# EAGLE design hardware-crackme (EAGLE 7.7.0)

## Sheet 1 of 2
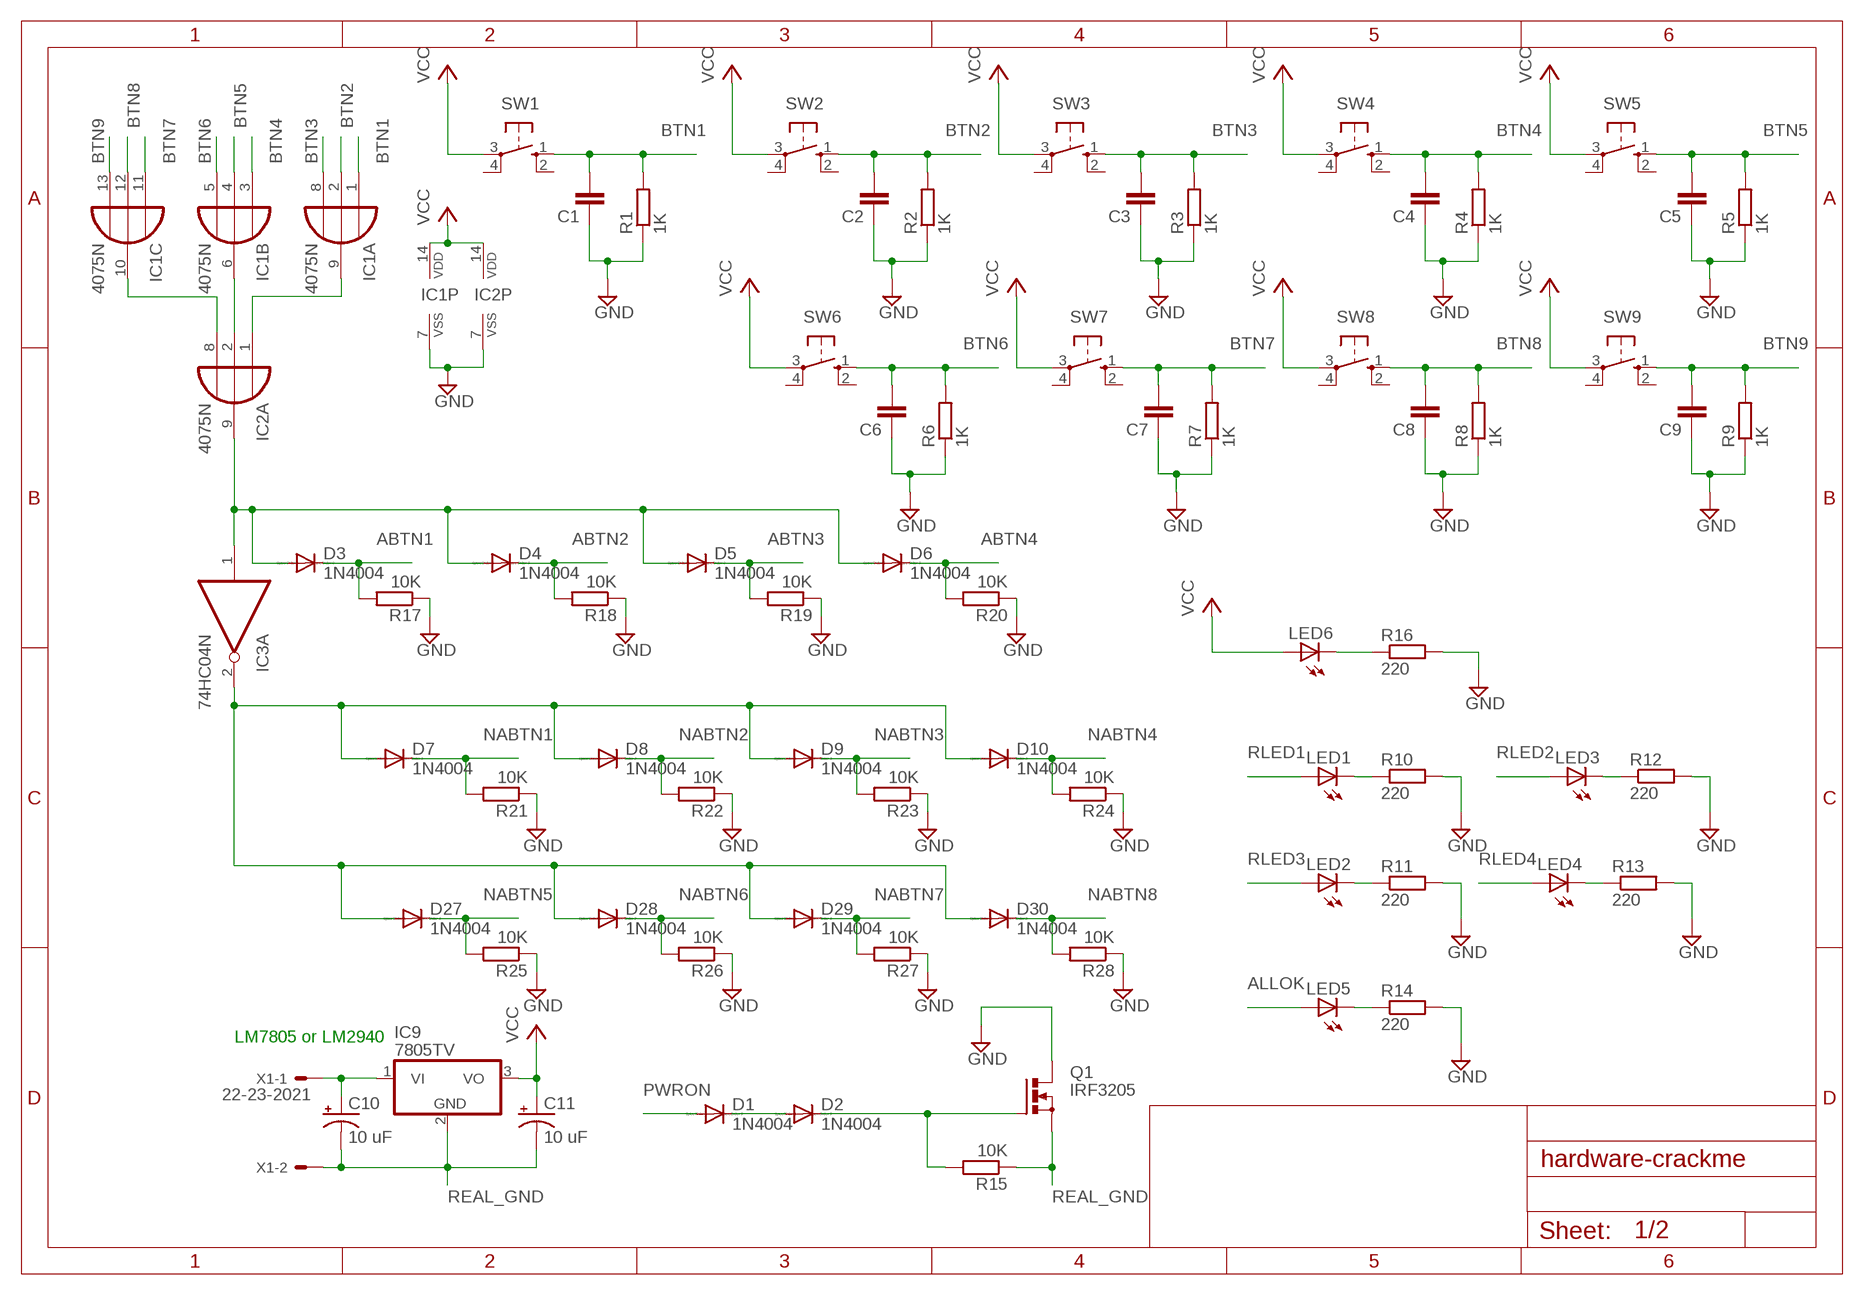
[diagram p0: schematic, sheet 1]

### Parts
C1  C-EU050-025X075  [C050-025X075]
C2  C-EU050-025X075  [C050-025X075]
C3  C-EU050-025X075  [C050-025X075]
C4  C-EU050-025X075  [C050-025X075]
C5  C-EU050-025X075  [C050-025X075]
C6  C-EU050-025X075  [C050-025X075]
C7  C-EU050-025X075  [C050-025X075]
C8  C-EU050-025X075  [C050-025X075]
C9  C-EU050-025X075  [C050-025X075]
C10  10 uF  CPOL-USE2.5-7  [E2,5-7]
C11  10 uF  CPOL-USE2.5-7  [E2,5-7]
D1  1N4004  [DO41-10]
D2  1N4004  [DO41-10]
D3  1N4004  [DO41-10]
D4  1N4004  [DO41-10]
D5  1N4004  [DO41-10]
D6  1N4004  [DO41-10]
D7  1N4004  [DO41-10]
D8  1N4004  [DO41-10]
D9  1N4004  [DO41-10]
D10  1N4004  [DO41-10]
D27  1N4004  [DO41-10]
D28  1N4004  [DO41-10]
D29  1N4004  [DO41-10]
D30  1N4004  [DO41-10]
IC1  4075N  [DIL14]
IC2  4075N  [DIL14]
IC3  74HC04N  [DIL14]
IC9  7805TV  [TO220V]
LED1  LED5MM  [LED5MM]
LED2  LED5MM  [LED5MM]
LED3  LED5MM  [LED5MM]
LED4  LED5MM  [LED5MM]
LED5  LED5MM  [LED5MM]
LED6  LED5MM  [LED5MM]
Q1  IRF3205  PMOSFET_NTO220BV  [TO220BV]
R1  1K  R-EU_0207/7  [0207/7]
R2  1K  R-EU_0207/7  [0207/7]
R3  1K  R-EU_0207/7  [0207/7]
R4  1K  R-EU_0207/7  [0207/7]
R5  1K  R-EU_0207/7  [0207/7]
R6  1K  R-EU_0207/7  [0207/7]
R7  1K  R-EU_0207/7  [0207/7]
R8  1K  R-EU_0207/7  [0207/7]
R9  1K  R-EU_0207/7  [0207/7]
R10  220  R-EU_0207/7  [0207/7]
R11  220  R-EU_0207/7  [0207/7]
R12  220  R-EU_0207/7  [0207/7]
R13  220  R-EU_0207/7  [0207/7]
R14  220  R-EU_0207/7  [0207/7]
R15  10K  R-EU_0207/7  [0207/7]
R16  220  R-EU_0207/7  [0207/7]
R17  10K  R-EU_0207/7  [0207/7]
R18  10K  R-EU_0207/7  [0207/7]
R19  10K  R-EU_0207/7  [0207/7]
R20  10K  R-EU_0207/7  [0207/7]
R21  10K  R-EU_0207/7  [0207/7]
R22  10K  R-EU_0207/7  [0207/7]
R23  10K  R-EU_0207/7  [0207/7]
R24  10K  R-EU_0207/7  [0207/7]
R25  10K  R-EU_0207/7  [0207/7]
R26  10K  R-EU_0207/7  [0207/7]
R27  10K  R-EU_0207/7  [0207/7]
R28  10K  R-EU_0207/7  [0207/7]
SW1  10-XX  [B3F-10XX]
SW2  10-XX  [B3F-10XX]
SW3  10-XX  [B3F-10XX]
SW4  10-XX  [B3F-10XX]
SW5  10-XX  [B3F-10XX]
SW6  10-XX  [B3F-10XX]
SW7  10-XX  [B3F-10XX]
SW8  10-XX  [B3F-10XX]
SW9  10-XX  [B3F-10XX]
X1  22-23-2021  [22-23-2021]

### Nets
ABTN1: D3.C R17.2 ; also sheet 2
ABTN2: D4.C R18.2 ; also sheet 2
ABTN3: D5.C R19.2 ; also sheet 2
ABTN4: D6.C R20.2 ; also sheet 2
ALLOK: LED5.A ; also sheet 2
BTN1: C1.2 IC1.1(A:I0) R1.2 SW1.1(S) ; also sheet 2
BTN2: C2.2 IC1.2(A:I1) R2.2 SW2.1(S) ; also sheet 2
BTN3: C3.2 IC1.8(A:I2) R3.2 SW3.1(S) ; also sheet 2
BTN4: C4.2 IC1.3(B:I0) R4.2 SW4.1(S) ; also sheet 2
BTN5: C5.2 IC1.4(B:I1) R5.2 SW5.1(S) ; also sheet 2
BTN6: C6.2 IC1.5(B:I2) R6.2 SW6.1(S) ; also sheet 2
BTN7: C7.2 IC1.11(C:I0) R7.2 SW7.1(S) ; also sheet 2
BTN8: C8.2 IC1.12(C:I1) R8.2 SW8.1(S) ; also sheet 2
BTN9: C9.2 IC1.13(C:I2) R9.2 SW9.1(S) ; also sheet 2
GND: C1.1 C2.1 C3.1 C4.1 C5.1 C6.1 C7.1 C8.1 C9.1 IC1.7(P:VSS) IC2.7(P:VSS) Q1.D R1.1 R2.1 R3.1 R4.1 R5.1 R6.1 R7.1 R8.1 R9.1 R10.2 R11.2 R12.2 R13.2 R14.2 R16.2 R17.1 R18.1 R19.1 R20.1 R21.1 R22.1 R23.1 R24.1 R25.1 R26.1 R27.1 R28.1 ; also sheet 2
N$1: C10.+ IC9.1(VI) X1.1
N$2: D2.C Q1.G R15.2
N$3: LED1.K(C) R10.1
N$4: D1.C D2.A
N$5: LED2.K(C) R11.1
N$6: LED6.K(C) R16.1
N$7: LED3.K(C) R12.1
N$9: LED4.K(C) R13.1
N$11: LED5.K(C) R14.1
N$20: IC1.9(A:O) IC2.1(A:I0)
N$21: IC1.6(B:O) IC2.2(A:I1)
N$22: IC1.10(C:O) IC2.8(A:I2)
N$30: D3.A D4.A D5.A D6.A IC2.9(A:O) IC3.1(A:I)
N$32: D7.A D8.A D9.A D10.A D27.A D28.A D29.A D30.A IC3.2(A:O)
NABTN1: D7.C R21.2 ; also sheet 2
NABTN2: D8.C R22.2 ; also sheet 2
NABTN3: D9.C R23.2 ; also sheet 2
NABTN4: D10.C R24.2 ; also sheet 2
NABTN5: D27.C R25.2 ; also sheet 2
NABTN6: D28.C R26.2 ; also sheet 2
NABTN7: D29.C R27.2 ; also sheet 2
NABTN8: D30.C R28.2 ; also sheet 2
PWRON: D1.A ; also sheet 2
REAL_GND: C10.- C11.- IC9.2(GND) Q1.S R15.1 X1.2
RLED1: LED1.A ; also sheet 2
RLED2: LED3.A ; also sheet 2
RLED3: LED2.A ; also sheet 2
RLED4: LED4.A ; also sheet 2
VCC: C11.+ IC1.14(P:VDD) IC2.14(P:VDD) IC9.3(VO) LED6.A SW1.3(P) SW2.3(P) SW3.3(P) SW4.3(P) SW5.3(P) SW6.3(P) SW7.3(P) SW8.3(P) SW9.3(P) ; also sheet 2
Unconnected: SW1.2(S1) SW1.4(P1) SW2.2(S1) SW2.4(P1) SW3.2(S1) SW3.4(P1) SW4.2(S1) SW4.4(P1) SW5.2(S1) SW5.4(P1) SW6.2(S1) SW6.4(P1) SW7.2(S1) SW7.4(P1) SW8.2(S1) SW8.4(P1) SW9.2(S1) SW9.4(P1)

### Notes on the sheet
- LM7805 or LM2940

## Sheet 2 of 2
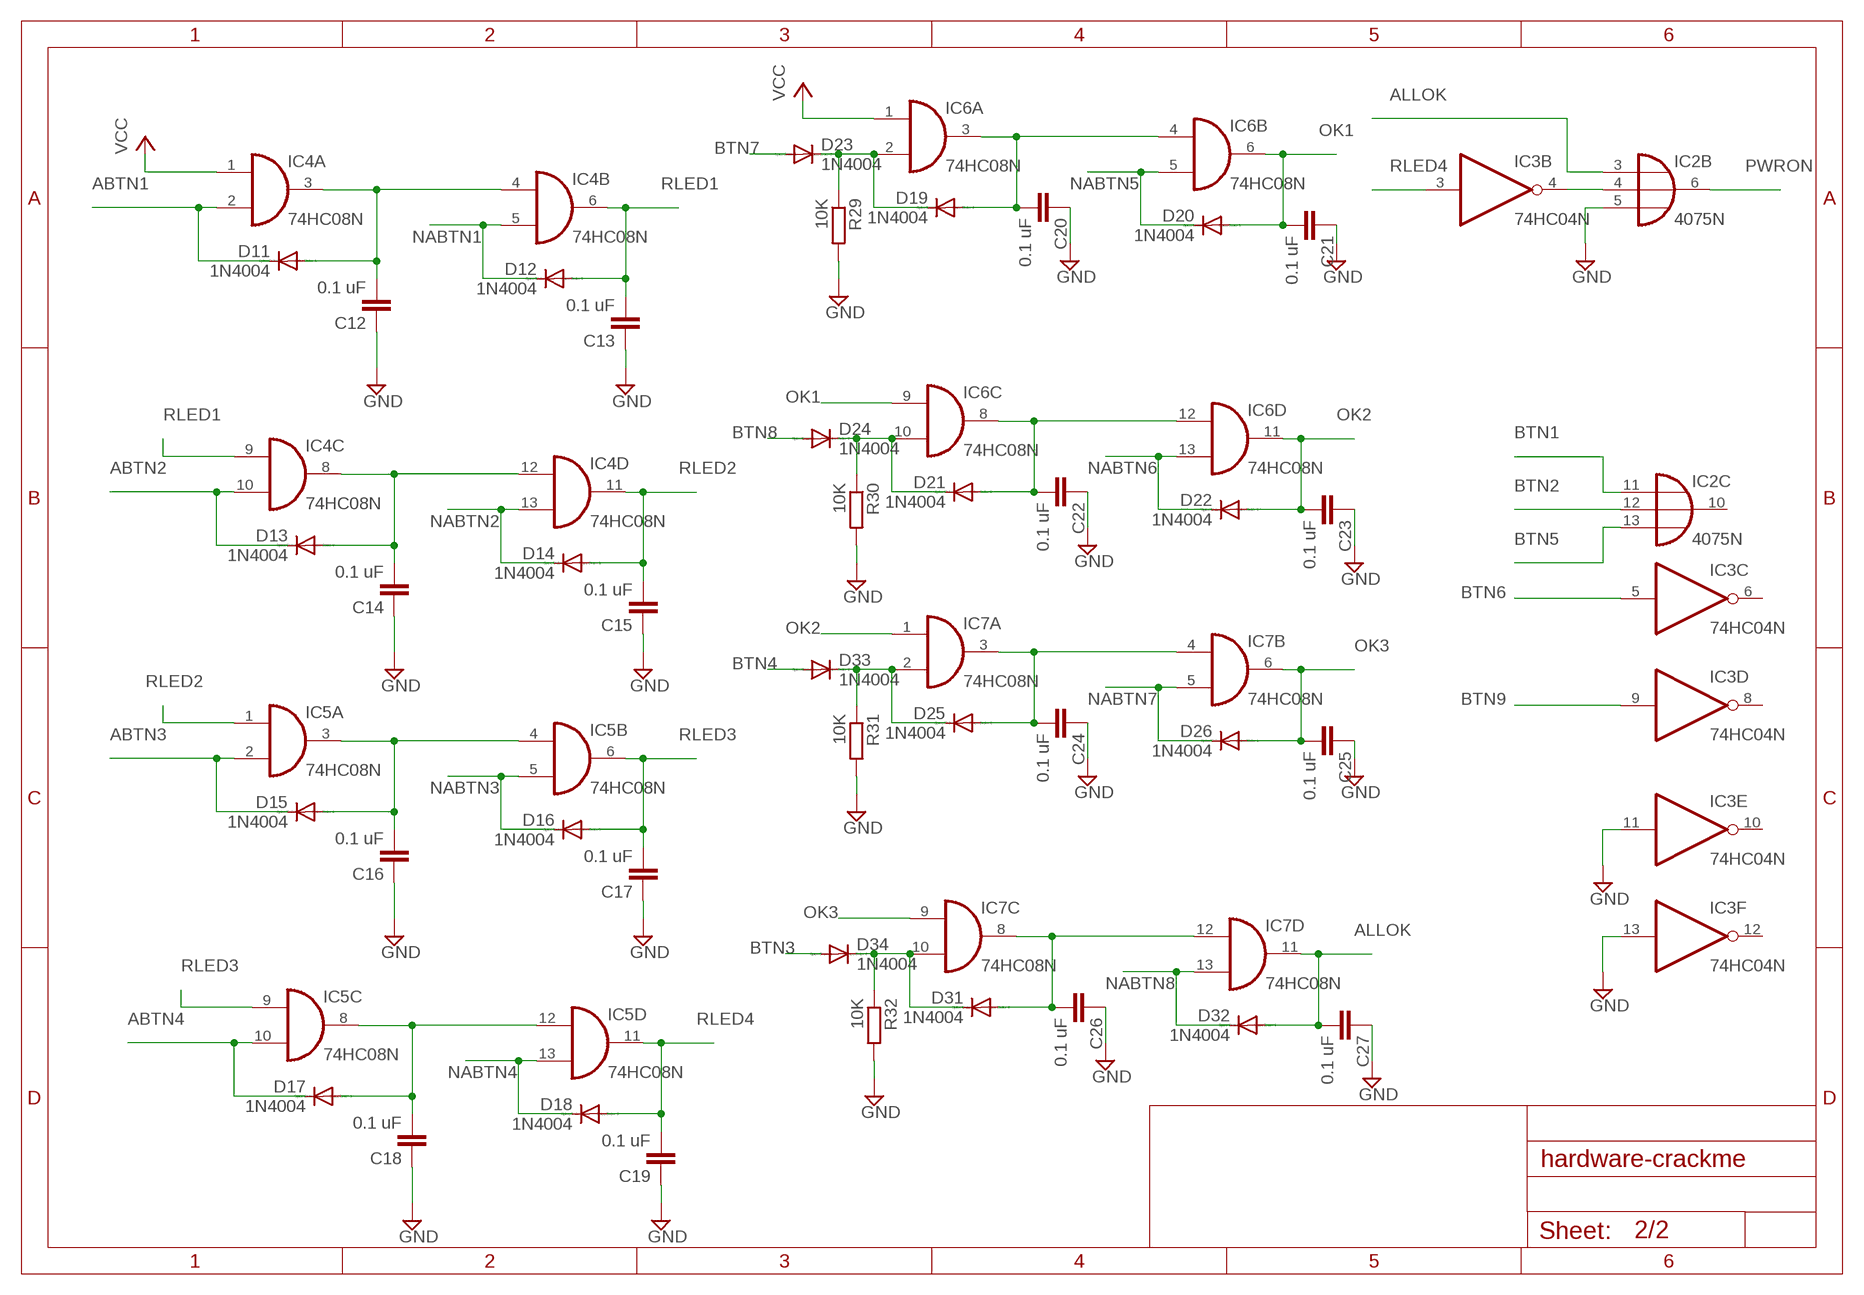
[diagram p1: schematic, sheet 2]

### Parts
C12  0.1 uF  C-EU050-025X075  [C050-025X075]
C13  0.1 uF  C-EU050-025X075  [C050-025X075]
C14  0.1 uF  C-EU050-025X075  [C050-025X075]
C15  0.1 uF  C-EU050-025X075  [C050-025X075]
C16  0.1 uF  C-EU050-025X075  [C050-025X075]
C17  0.1 uF  C-EU050-025X075  [C050-025X075]
C18  0.1 uF  C-EU050-025X075  [C050-025X075]
C19  0.1 uF  C-EU050-025X075  [C050-025X075]
C20  0.1 uF  C-EU050-025X075  [C050-025X075]
C21  0.1 uF  C-EU050-025X075  [C050-025X075]
C22  0.1 uF  C-EU050-025X075  [C050-025X075]
C23  0.1 uF  C-EU050-025X075  [C050-025X075]
C24  0.1 uF  C-EU050-025X075  [C050-025X075]
C25  0.1 uF  C-EU050-025X075  [C050-025X075]
C26  0.1 uF  C-EU050-025X075  [C050-025X075]
C27  0.1 uF  C-EU050-025X075  [C050-025X075]
D11  1N4004  [DO41-10]
D12  1N4004  [DO41-10]
D13  1N4004  [DO41-10]
D14  1N4004  [DO41-10]
D15  1N4004  [DO41-10]
D16  1N4004  [DO41-10]
D17  1N4004  [DO41-10]
D18  1N4004  [DO41-10]
D19  1N4004  [DO41-10]
D20  1N4004  [DO41-10]
D21  1N4004  [DO41-10]
D22  1N4004  [DO41-10]
D23  1N4004  [DO41-10]
D24  1N4004  [DO41-10]
D25  1N4004  [DO41-10]
D26  1N4004  [DO41-10]
D31  1N4004  [DO41-10]
D32  1N4004  [DO41-10]
D33  1N4004  [DO41-10]
D34  1N4004  [DO41-10]
IC4  74HC08N  [DIL14]
IC5  74HC08N  [DIL14]
IC6  74HC08N  [DIL14]
IC7  74HC08N  [DIL14]
R29  10K  R-EU_0207/7  [0207/7]
R30  10K  R-EU_0207/7  [0207/7]
R31  10K  R-EU_0207/7  [0207/7]
R32  10K  R-EU_0207/7  [0207/7]

### Nets
ABTN1: D11.C IC4.2(A:I1) ; also sheet 1
ABTN2: D13.C IC4.10(C:I1) ; also sheet 1
ABTN3: D15.C IC5.2(A:I1) ; also sheet 1
ABTN4: D17.C IC5.10(C:I1) ; also sheet 1
ALLOK: C27.2 D32.A IC2.3(B:I0) IC7.11(D:O) ; also sheet 1
BTN1: IC2.11(C:I0) ; also sheet 1
BTN2: IC2.12(C:I1) ; also sheet 1
BTN3: D34.A ; also sheet 1
BTN4: D33.A ; also sheet 1
BTN5: IC2.13(C:I2) ; also sheet 1
BTN6: IC3.5(C:I) ; also sheet 1
BTN7: D23.A ; also sheet 1
BTN8: D24.A ; also sheet 1
BTN9: IC3.9(D:I) ; also sheet 1
GND: C12.1 C13.1 C14.1 C15.1 C16.1 C17.1 C18.1 C19.1 C20.1 C21.1 C22.1 C23.1 C24.1 C25.1 C26.1 C27.1 IC2.5(B:I2) IC3.11(E:I) IC3.13(F:I) R29.2 R30.2 R31.2 R32.2 ; also sheet 1
N$10: C12.2 D11.A IC4.3(A:O) IC4.4(B:I0)
N$13: C14.2 D13.A IC4.8(C:O) IC4.12(D:I0)
N$14: IC2.4(B:I1) IC3.4(B:O)
N$15: C16.2 D15.A IC5.3(A:O) IC5.4(B:I0)
N$17: C18.2 D17.A IC5.8(C:O) IC5.12(D:I0)
N$19: C20.2 D19.A IC6.3(A:O) IC6.4(B:I0)
N$24: C22.2 D21.A IC6.8(C:O) IC6.12(D:I0)
N$26: D21.C D24.C IC6.10(C:I1) R30.1
N$29: D19.C D23.C IC6.2(A:I1) R29.1
N$31: C24.2 D25.A IC7.3(A:O) IC7.4(B:I0)
N$34: C26.2 D31.A IC7.8(C:O) IC7.12(D:I0)
N$36: D31.C D34.C IC7.10(C:I1) R32.1
N$39: D25.C D33.C IC7.2(A:I1) R31.1
NABTN1: D12.C IC4.5(B:I1) ; also sheet 1
NABTN2: D14.C IC4.13(D:I1) ; also sheet 1
NABTN3: D16.C IC5.5(B:I1) ; also sheet 1
NABTN4: D18.C IC5.13(D:I1) ; also sheet 1
NABTN5: D20.C IC6.5(B:I1) ; also sheet 1
NABTN6: D22.C IC6.13(D:I1) ; also sheet 1
NABTN7: D26.C IC7.5(B:I1) ; also sheet 1
NABTN8: D32.C IC7.13(D:I1) ; also sheet 1
OK1: C21.2 D20.A IC6.6(B:O) IC6.9(C:I0)
OK2: C23.2 D22.A IC6.11(D:O) IC7.1(A:I0)
OK3: C25.2 D26.A IC7.6(B:O) IC7.9(C:I0)
PWRON: IC2.6(B:O) ; also sheet 1
RLED1: C13.2 D12.A IC4.6(B:O) IC4.9(C:I0) ; also sheet 1
RLED2: C15.2 D14.A IC4.11(D:O) IC5.1(A:I0) ; also sheet 1
RLED3: C17.2 D16.A IC5.6(B:O) IC5.9(C:I0) ; also sheet 1
RLED4: C19.2 D18.A IC3.3(B:I) IC5.11(D:O) ; also sheet 1
VCC: IC4.1(A:I0) IC6.1(A:I0) ; also sheet 1
Unconnected: IC2.10(C:O) IC3.6(C:O) IC3.8(D:O) IC3.10(E:O) IC3.12(F:O)

## Power pins joined to a net without a drawn wire
GND: IC3.7(P:GND) IC4.7(P:GND) IC5.7(P:GND) IC6.7(P:GND) IC7.7(P:GND)
VCC: IC3.14(P:VCC) IC4.14(P:VCC) IC5.14(P:VCC) IC6.14(P:VCC) IC7.14(P:VCC)

## Library data of the parts
C1-C9 C12-C27 = rcl:C-EU: CAPACITOR, European symbol
C10 C11 = rcl:CPOL-US: POLARIZED CAPACITOR, American symbol
D1-D34 = diode:1N4004: DIODE general purpose rectifier, 1 A
IC1 = 40xx:4075: Triple 3-input OR; SUPPLY: VCC
IC2 = 40xx:4075: Triple 3-input OR
IC3 = 74xx-eu:74*04: Hex INVERTER
IC4-IC7 = 74xx-eu:74*08: Quad 2-input AND gate
IC9 = linear:78*: Positive VOLTAGE REGULATOR Source: http://cache.national.com/ds/LM/LM78L05.pdf http://www.fairchildsemi.com/ds/LM/LM7805.pdf
LED1-LED6 = led:LED: LED OSRAM: - CHIPLED LG R971, LG N971, LY N971, LG Q971, LY Q971, LO R971, LY R971 LH N974, LH R974 LS Q976, LO Q976, LY Q976 LO Q996 - Hyper CHIPLED LW Q18S LB Q993, LB Q99A, LB R99A - SideLED LS A670, LO A670, LY A670, LG A670, LP A670 LB A673, LV A673, LT A673, LW A673 LH A674 LY A675 LS A676, LA A676, LO A676, LY A676, LW A676 LS A679, LY A679, LG A679 - Hyper Micro SIDELED® LS Y876, LA Y876, LO Y876, LY Y876 LT Y87S - SmartLED LW L88C, LW L88S LB L89C, LB L89S, LG L890 LS L89K, LO L89K, LY L89K LS L896, LA L896, LO L896, LY L896 - TOPLED LS T670, LO T670, LY T670, LG T670, LP T670 LSG T670, LSP T670, LSY T670, LOP T670, LYG T670 LG T671, LOG T671, LSG T671 LB T673, LV T673, LT T673, LW T673 LH T674 LS T676, LA T676, LO T676, LY T676, LB T676, LH T676, LSB T676, LW T676 LB T67C, LV T67C, LT T67C, LS T67K, LO T67K, LY T67K, LW E67C LS E67B, LA E67B, LO E67B, LY E67B, LB E67C, LV E67C, LT E67C LW T67C LS T679, LY T679, LG T679 LS T770, LO T770, LY T770, LG T770, LP T770 LB T773, LV T773, LT T773, LW T773 LH T774 LS E675, LA E675, LY E675, LS T675 LS T776, LA T776, LO T776, LY T776, LB T776 LHGB T686 LT T68C, LB T68C - Hyper Mini TOPLED® LB M676 - Mini TOPLED Santana® LG M470 LS M47K, LO M47K, LY M47K Source: http://www.osram.convergy.de LUXEON: - LUMILED® LXK2-PW12-R00, LXK2-PW12-S00, LXK2-PW14-U00, LXK2-PW14-V00 LXK2-PM12-R00, LXK2-PM12-S00, LXK2-PM14-U00 LXK2-PE12-Q00, LXK2-PE12-R00, LXK2-PE12-S00, LXK2-PE14-T00, LXK2-PE14-U00 LXK2-PB12-K00, LXK2-PB12-L00, LXK2-PB12-M00, LXK2-PB14-N00, LXK2-PB14-P00, LXK2-PB14-Q00 LXK2-PR12-L00, LXK2-PR12-M00, LXK2-PR14-Q00, LXK2-PR14-R00 LXK2-PD12-Q00, LXK2-PD12-R00, LXK2-PD12-S00 LXK2-PH12-R00, LXK2-PH12-S00 LXK2-PL12-P00, LXK2-PL12-Q00, LXK2-PL12-R00 Source: www.luxeon.com KINGBRIGHT: KA-3528ASYC Source: www.kingbright.com
Q1 = transistor-power:PMOSFET_N: Power MOSFET N-Channel
R1-R32 = resistor:R-EU_: RESISTOR, European symbol
SW1-SW9 = buttons:10-XX: OMRON SWITCH
X1 = con-molex:22-23-2021: .100" (2.54mm) Center Header - 2 Pin; MF: MOLEX; MPN: 22-23-2021; OC_FARNELL: 1462926; OC_NEWARK: 25C3832

## Board
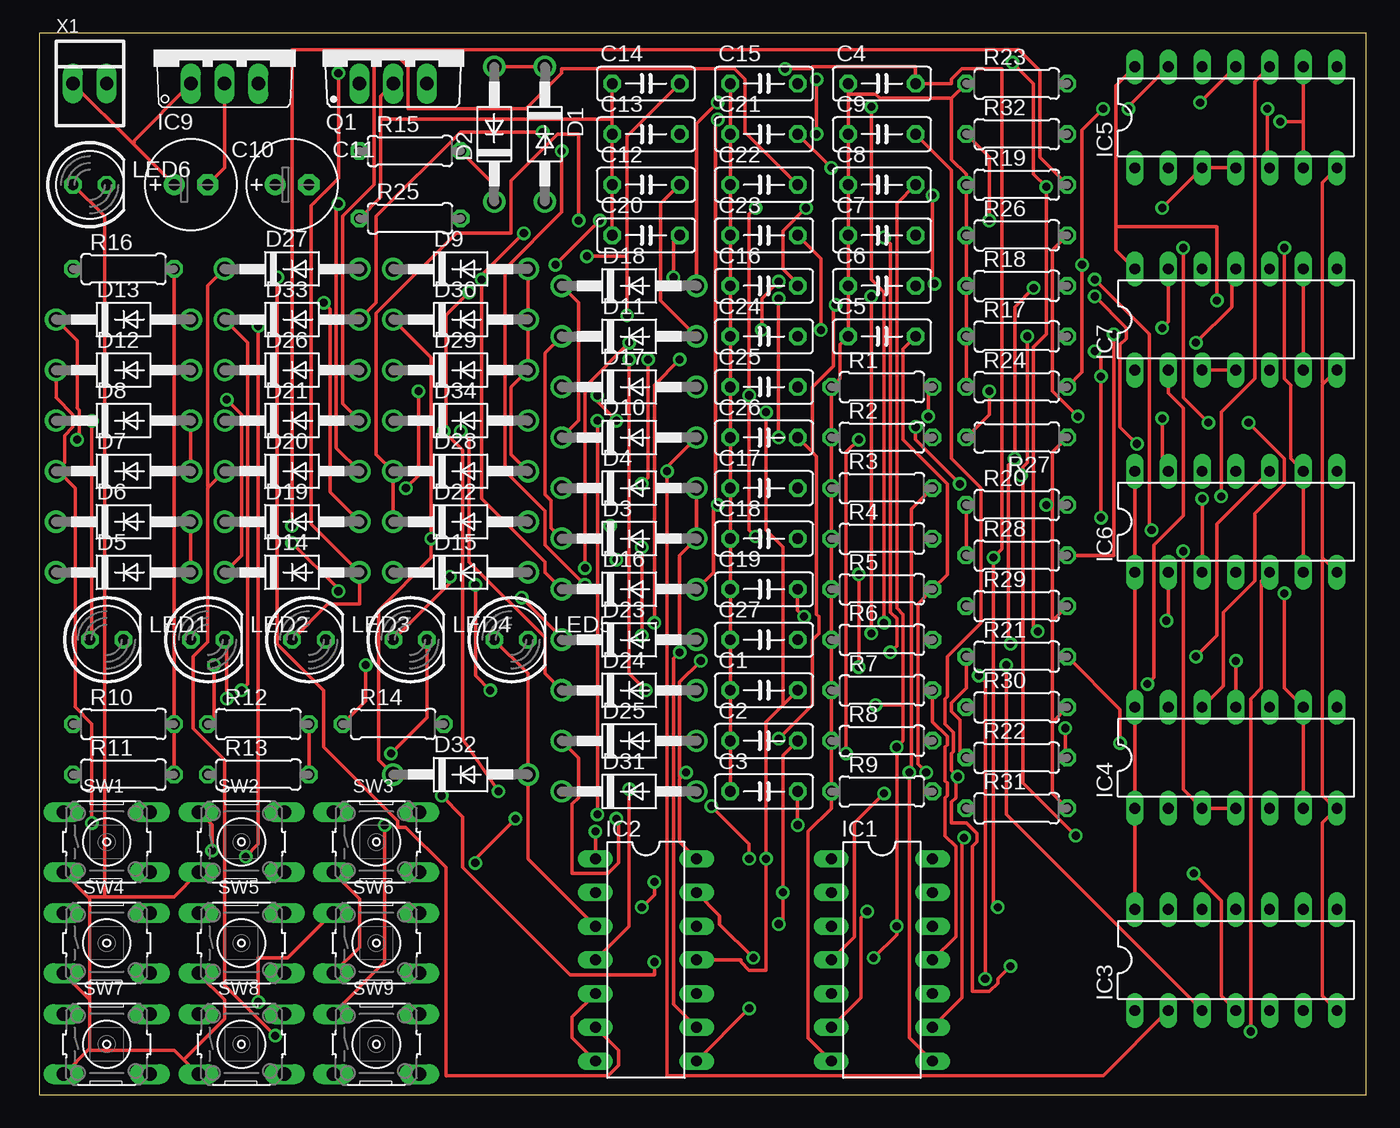
[diagram p2: board, top side]
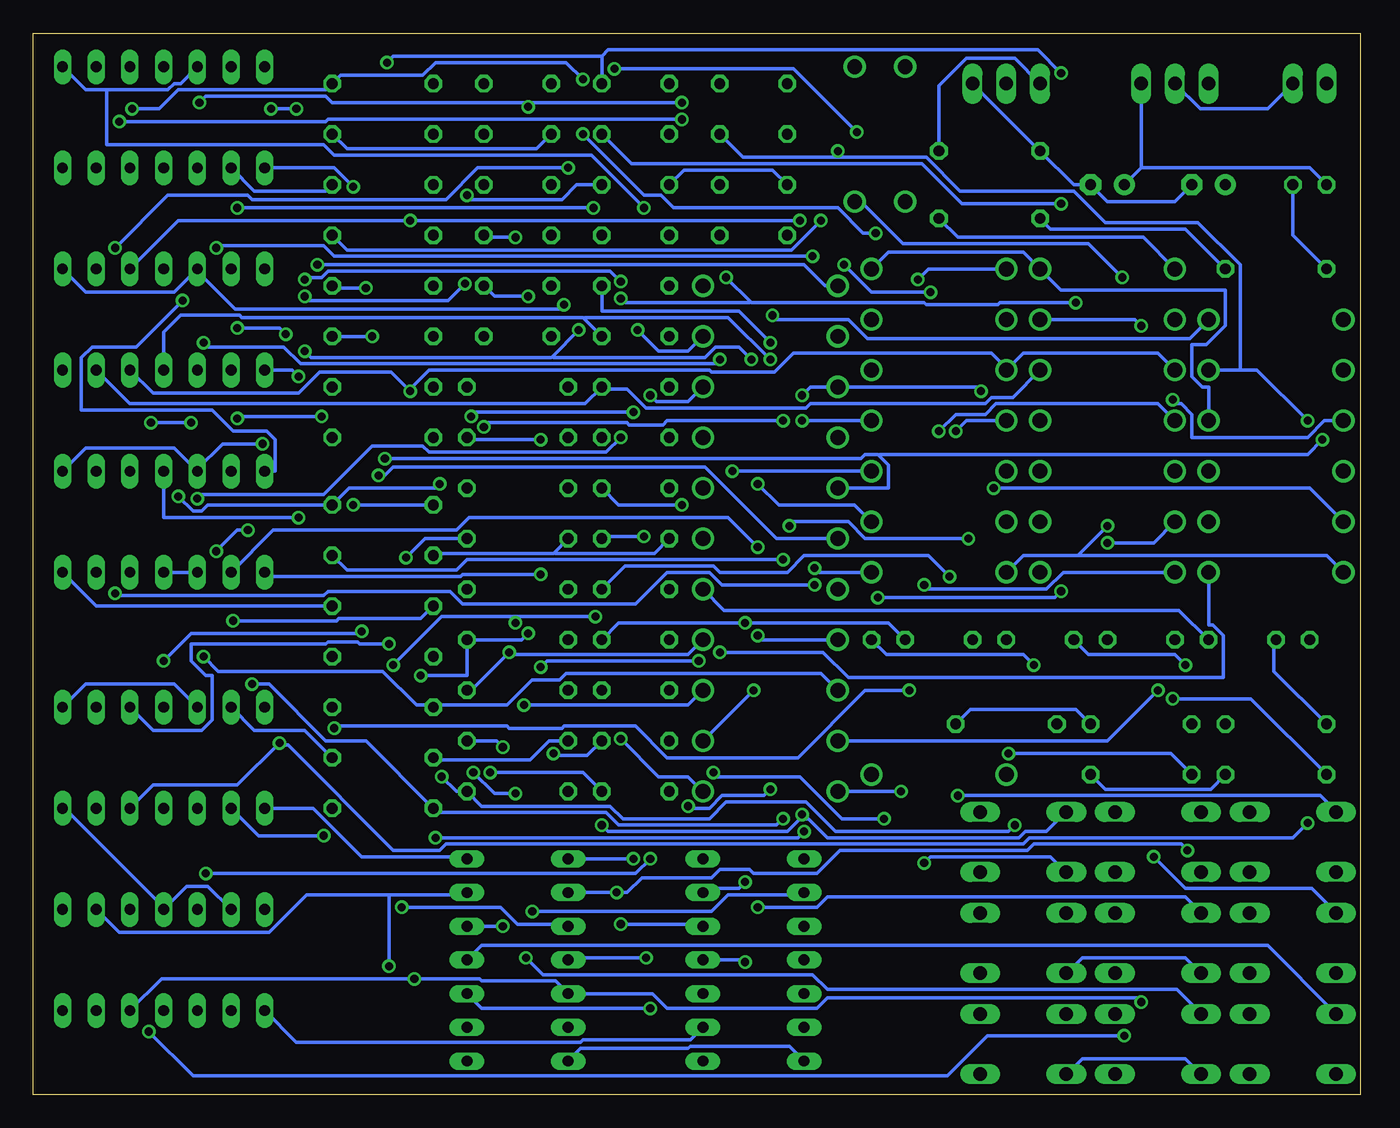
[diagram p3: board, bottom side, seen from below]

Size 100 x 80 mm. Coordinates in mm from the lower left corner, seen from the top.
Outline: 0,0 100,0 100,80 0,80 0,0
Copper layers (1*16): Top 0.035mm / dielectric 1.5mm / Bottom 0.035mm
Design rules "default": minimum track width 10mil, minimum drill 24mil, track to track 8mil, track to pad 8mil, pad to pad 8mil, via to via 8mil, smd to smd 8mil, copper to edge 40mil, drill to drill 8mil, minimum pad ring 10mil, minimum via ring 8mil, stop-mask expansion 4mil, vias tented up to drill 0mil, thermal gap 10mil

### Footprints (pad centres in the part's own frame; a part is rotated, then mirrored left to right if it is on the bottom)
C050-025X075 = drill 0.813 octagon: 1 -2.54,0; 2 2.54,0
E2,5-7 = drill 0.813 pad 1.6: + -1.27,0 | drill 0.813 pad 1.6 octagon: - 1.27,0
DO41-10 = drill 1.118: A 5.08,0; C -5.08,0
DIL14 = drill 0.813 long: 1 -7.62,-3.81; 2 -5.08,-3.81; 3 -2.54,-3.81; 4 0,-3.81; 5 2.54,-3.81; 6 5.08,-3.81; 7 7.62,-3.81; 8 7.62,3.81; 9 5.08,3.81; 10 2.54,3.81; 11 0,3.81; 12 -2.54,3.81; 13 -5.08,3.81; 14 -7.62,3.81
TO220V = drill 1.016 long: 1 -2.54,-2.54; 2 0,-2.54; 3 2.54,-2.54
LED5MM = drill 0.813 octagon: A -1.27,0; K 1.27,0
TO220BV = drill 1.016 long: D 0,-2.54; G -2.54,-2.54; S 2.54,-2.54
0207/7 = drill 0.813 octagon: 1 -3.81,0; 2 3.81,0
B3F-10XX = drill 1.016 long: 1 -3.251,2.261; 2 3.251,2.261; 3 -3.251,-2.261; 4 3.251,-2.261
22-23-2021 = drill 1 long: 1 -1.27,0; 2 1.27,0

### Placement (x,y rotation side)
C1  54.61,30.48 0 top
C2  54.61,26.67 0 top
C3  54.61,22.86 0 top
C4  63.5,76.2 0 top
C5  63.5,57.15 0 top
C6  63.5,60.96 0 top
C7  63.5,64.77 0 top
C8  63.5,68.58 0 top
C9  63.5,72.39 0 top
C10  11.43,68.58 0 top
C11  19.05,68.58 0 top
C12  45.72,68.58 0 top
C13  45.72,72.39 0 top
C14  45.72,76.2 0 top
C15  54.61,76.2 0 top
C16  54.61,60.96 0 top
C17  54.61,45.72 0 top
C18  54.61,41.91 0 top
C19  54.61,38.1 0 top
C20  45.72,64.77 0 top
C21  54.61,72.39 0 top
C22  54.61,68.58 0 top
C23  54.61,64.77 0 top
C24  54.61,57.15 0 top
C25  54.61,53.34 0 top
C26  54.61,49.53 0 top
C27  54.61,34.29 0 top
D1  38.1,72.39 270 top
D2  34.29,72.39 90 top
D3  44.45,41.91 0 top
D4  44.45,45.72 0 top
D5  6.35,39.37 0 top
D6  6.35,43.18 0 top
D7  6.35,46.99 0 top
D8  6.35,50.8 0 top
D9  31.75,62.23 0 top
D10  44.45,49.53 0 top
D11  44.45,57.15 0 top
D12  6.35,54.61 0 top
D13  6.35,58.42 0 top
D14  19.05,39.37 0 top
D15  31.75,39.37 0 top
D16  44.45,38.1 0 top
D17  44.45,53.34 0 top
D18  44.45,60.96 0 top
D19  19.05,43.18 0 top
D20  19.05,46.99 0 top
D21  19.05,50.8 0 top
D22  31.75,43.18 0 top
D23  44.45,34.29 0 top
D24  44.45,30.48 0 top
D25  44.45,26.67 0 top
D26  19.05,54.61 0 top
D27  19.05,62.23 0 top
D28  31.75,46.99 0 top
D29  31.75,54.61 0 top
D30  31.75,58.42 0 top
D31  44.45,22.86 0 top
D32  31.75,24.13 0 top
D33  19.05,58.42 0 top
D34  31.75,50.8 0 top
IC1  63.5,10.16 270 top
IC2  45.72,10.16 270 top
IC3  90.17,10.16 0 top
IC4  90.17,25.4 0 top
IC5  90.17,73.66 0 top
IC6  90.17,43.18 0 top
IC7  90.17,58.42 0 top
IC9  13.97,78.74 0 top
LED1  5.08,34.29 0 top
LED2  12.7,34.29 0 top
LED3  20.32,34.29 0 top
LED4  27.94,34.29 0 top
LED5  35.56,34.29 0 top
LED6  3.81,68.58 0 top
Q1  26.67,78.74 0 top
R1  63.5,53.34 0 top
R2  63.5,49.53 0 top
R3  63.5,45.72 0 top
R4  63.5,41.91 0 top
R5  63.5,38.1 0 top
R6  63.5,34.29 0 top
R7  63.5,30.48 0 top
R8  63.5,26.67 0 top
R9  63.5,22.86 0 top
R10  6.35,27.94 0 top
R11  6.35,24.13 0 top
R12  16.51,27.94 0 top
R13  16.51,24.13 0 top
R14  26.67,27.94 0 top
R15  27.94,71.12 0 top
R16  6.35,62.23 0 top
R17  73.66,57.15 0 top
R18  73.66,60.96 0 top
R19  73.66,68.58 0 top
R20  73.66,44.45 0 top
R21  73.66,33.02 0 top
R22  73.66,25.4 0 top
R23  73.66,76.2 0 top
R24  73.66,53.34 0 top
R25  27.94,66.04 0 top
R26  73.66,64.77 0 top
R27  73.66,49.53 180 top
R28  73.66,40.64 0 top
R29  73.66,36.83 0 top
R30  73.66,29.21 0 top
R31  73.66,21.59 0 top
R32  73.66,72.39 0 top
SW1  5.08,19.05 0 top
SW2  15.24,19.05 0 top
SW3  25.4,19.05 0 top
SW4  5.08,11.43 0 top
SW5  15.24,11.43 0 top
SW6  25.4,11.43 0 top
SW7  5.08,3.81 0 top
SW8  15.24,3.81 0 top
SW9  25.4,3.81 0 top
X1  3.81,76.2 0 top

### Tracks (layer width: path | path; a pad name or v marks a point on that pad's centre or on a via)
ABTN1  (via drill 0.61)
  Top 0.254: D3.C 38.58,42.7 38.58,44.77 38.1,45.24 38.1,55.88 D11.C | v78.11,19.53 74.14,23.5 74.14,46.67 | 74.14,46.67 74.14,47.31 74.45,47.62 v74.45,57.15 | 74.14,46.67 v73.98,46.67
  Bottom 0.254: IC4.2 83.03,19.53 v78.11,19.53 | R17.2 v74.45,57.15 | D3.C 43.97,41.91 49.37,47.31 72.87,47.31 73.5,46.67 v73.98,46.67
ABTN2  (via drill 0.61)
  Top 0.254: v74.93,60.8 73.5,59.37 v73.5,47.94 73.03,47.47 73.03,34.13 v73.18,33.97 | D13.C 2.86,56.83 2.86,51.75 3.02,51.59 3.02,49.53 v2.86,49.37
  Bottom 0.254: R18.2 77.31,60.8 v74.93,60.8 | v73.5,47.94 37.62,47.94 37.31,48.26 36.35,48.26 36.27,48.18 | 36.27,48.18 35.56,47.47 35.56,45.72 D4.C | IC4.10 90.96,27.46 87.31,27.46 86.52,28.26 86.52,31.59 87,31.59 88.11,32.7 88.11,33.97 77.95,33.97 77.79,34.13 75.56,34.13 75.41,33.97 v73.18,33.97 | v2.86,49.37 3.97,48.26 36.2,48.26 36.27,48.18
ABTN3  (via drill 0.61)
  Top 0.254: R19.2 75.41,70.64 75.41,77.15 73.82,78.74 19.05,78.74 v19.05,42.86
  Bottom 0.254: R19.2 77.95,68.1 83.34,68.1 IC5.2 | D5.C 2.54,40.64 21.27,40.64 | 21.27,40.64 25.4,40.64 D15.C | 21.27,40.64 v19.05,42.86
ABTN4  (via drill 0.61)
  Top 0.254: v89.06,45.09 89.06,51.44 91.6,53.98 91.6,76.36 IC5.10 | v27.62,45.72 28.57,46.67 v28.57,53.02 | v69.37,46.04 66.04,49.37 v66.04,50.32 | v43.5,50.8 42.07,52.23 v42.07,52.7
  Bottom 0.254: v89.06,45.09 87.95,43.97 87.31,43.97 86.84,44.45 R20.2 76.2,45.72 69.69,45.72 v69.37,46.04 | D6.C 3.81,45.72 v27.62,45.72 | v28.57,53.02 28.89,53.34 D17.C 41.43,53.34 v42.07,52.7 | v66.04,50.32 65.72,50.64 55.24,50.64 55.09,50.48 52.55,50.48 52.23,50.8 v43.5,50.8
ALLOK  (via drill 0.61)
  Top 0.254: IC2.3 36.83,17.78 D32.A 36.83,31.75 LED5.A | IC7.11 89.85,61.91 89.85,59.37 v87.15,56.67 | v48.26,55.4 46.35,53.5 v46.35,35.56
  Bottom 0.254: C27.2 55.88,35.56 v46.35,35.56 35.56,35.56 LED5.A | v87.15,56.67 86.84,56.36 81.12,56.36 79.85,55.09 48.58,55.09 v48.26,55.4
BTN1  (via drill 0.61)
  Top 0.254: IC2.11 52.86,10.16 52.86,10 53.5,9.37 54.77,9.37 v54.77,17.78 54.77,28.1 56.12,29.45 | C1.2 56.12,29.45 | R1.2 66.99,53.02 v66.99,51.12 | v54.77,51.44 54.77,42.55 56.04,41.27 56.04,29.53 56.12,29.45 | v30.32,22.54 31.91,20.95 31.91,17.14 40.01,9.05 46.35,9.05 v46.35,10
  Bottom 0.254: v54.77,17.78 IC1.1 | v66.99,51.12 66.67,51.44 v54.77,51.44 | v30.32,22.54 3.02,22.54 1.91,21.43 SW1.1 | v46.35,10 46.51,10.16 IC2.11
BTN2  (via drill 0.61)
  Top 0.254: v55.72,12.86 56.04,13.18 v56.04,15.24 56.04,25.56 C2.2 | v61.75,49.37 60.8,48.42 v60.8,25.72 | v13.02,18.41 13.02,20.32 12.06,21.27 SW2.1
  Bottom 0.254: IC2.12 49.69,12.86 v55.72,12.86 | IC1.2 v56.04,15.24 55.24,15.24 54.13,16.35 48.9,16.35 48.26,16.99 46.04,16.99 45.72,16.67 40.96,16.67 39.21,18.41 25.08,18.41 24.61,18.89 13.49,18.89 v13.02,18.41 | R2.2 67.15,49.37 v61.75,49.37 | v60.8,25.72 60.64,25.56 58.26,25.56 C2.2
BTN3  (via drill 0.61)
  Top 0.254: R3.2 65.72,44.13 65.72,24.45 v65.56,24.29 65.56,4.29 IC1.8 | C3.2 v57.15,20.32 | v42.07,21.11 v42.07,50.8
  Bottom 0.254: C3.2 58.58,24.29 v65.56,24.29 | 42.07,20.8 42.23,20.8 43.18,19.84 56.67,19.84 v57.15,20.32 | 42.07,20.8 41.59,20.8 40.16,19.37 25.72,19.37 25.24,19.84 23.65,19.84 22.23,21.27 SW3.1 | v42.07,50.8 D34.A | 42.07,20.8 v42.07,21.11
BTN4  (via drill 0.61)
  Top 0.254: v15.56,17.94 16.51,18.89 v16.51,57.94 | v72.23,14.13 71.91,14.45 v71.91,40.48 72.55,41.12 72.55,77.31 69.53,77.31 68.74,76.52 68.74,76.2 C4.2 66.04,77.47 58.26,77.47 58.1,77.31 v56.2,77.31 | D33.A 25.4,59.69 25.4,66.2 31.75,72.55 v37.94,72.55
  Bottom 0.254: v15.56,17.94 13.18,15.56 3.65,15.56 1.91,13.81 SW4.1 | v16.51,57.94 16.99,58.42 D33.A | IC1.3 59.85,12.86 63.5,12.86 64.77,14.13 v72.23,14.13 | v71.91,40.48 70.48,41.91 R4.2 | v37.94,72.55 42.7,77.31 v56.2,77.31
BTN5  (via drill 0.61)
  Top 0.254: C5.2 65.09,56.2 65.09,49.37 68.42,46.04 68.42,39.21 R5.2 66.2,36.99 66.2,24.92 v66.83,24.29 | v53.82,10.32 51.28,12.86 51.28,13.49 IC2.13 | v45.4,14.13 46.35,15.08 v46.35,16.03 | v63.66,22.7 61.44,20.48 61.44,11.91 IC1.4
  Bottom 0.254: IC1.4 59.53,10.32 v53.82,10.32 | v45.4,14.13 40.96,14.13 40.16,14.92 13.18,14.92 12.06,13.81 SW5.1 | v46.35,16.03 46.83,15.56 49.21,15.56 IC2.13 | v66.83,24.29 65.25,22.7 v63.66,22.7
BTN6  (via drill 0.61)
  Top 0.254: v70.8,31.59 71.28,31.11 v71.28,8.73 | v62.71,34.77 v62.71,60.17 | v16.51,6.99 16.51,10.32 18.73,10.32 22.07,13.65 SW6.1
  Bottom 0.254: IC3.5 90.33,8.73 v71.28,8.73 66.36,8.73 66.2,8.57 60.64,8.57 IC1.5 53.34,7.62 52.23,6.51 40.96,6.51 40.16,7.3 16.83,7.3 v16.51,6.99 | v70.8,31.59 67.31,31.59 R6.2 63.18,34.29 v62.71,34.77 | C6.2 65.25,60.17 v62.71,60.17
BTN7  (via drill 0.61)
  Top 0.254: IC1.11 69.06,11.91 69.06,18.73 68.26,19.53 68.26,22.38 68.42,22.54 68.42,23.5 68.26,23.65 68.26,26.19 68.42,26.35 68.42,26.99 67.31,28.1 R7.2 | v63.66,64.61 64.14,64.14 64.14,36.35 64.61,35.88 64.61,33.81 v64.14,33.34
  Bottom 0.254: C7.2 65.88,64.61 v63.66,64.61 | R7.2 66.99,30.48 v64.14,33.34 64.14,33.18 50.64,33.18 D23.A | IC1.11 66.2,11.27 6.99,11.27 1.91,6.19 SW7.1
BTN8  (via drill 0.61)
  Top 0.254: C8.2 64.61,67.15 64.61,36.67 65.09,36.2 65.09,29.37 | 65.09,29.37 65.09,26.67 v64.61,26.19 v64.61,12.7 64.61,12.06 v62.87,10.32 | 65.09,29.37 v63.02,29.37
  Bottom 0.254: v64.61,12.7 IC1.12 | v64.61,26.19 65.09,26.67 R8.2 | v62.87,10.32 61.59,9.05 41.27,9.05 40.16,7.94 13.81,7.94 12.06,6.19 SW8.1 | D24.A 50.64,29.37 v63.02,29.37
BTN9  (via drill 0.61)
  Top 0.254: C9.2 68.74,69.69 68.74,47.94 70.96,45.72 70.96,35.56 68.42,33.02 68.42,30 68.26,29.84 68.26,27.94 68.9,27.3 68.9,25.88 68.74,25.72 68.74,24.45 v69.22,23.97 69.06,23.97 69.06,22.38 68.74,22.07 68.74,20.48 69.85,20.48 70.64,19.68 70.64,19.05 70.33,18.73 70.33,7.78 71.6,7.78 72.23,8.41 72.23,8.73 v73.18,9.68 | v26.04,20.32 26.04,10 22.23,6.19 SW9.1
  Bottom 0.254: IC1.13 67.47,15.08 73.18,15.08 | 73.18,15.08 79.38,15.08 82.23,12.22 93.5,12.22 IC3.9 | v69.22,23.97 68.1,22.86 R9.2 66.2,21.75 56.52,21.75 55.56,20.8 49.05,20.8 47.78,22.07 41.75,22.07 39.53,19.84 26.51,19.84 v26.04,20.32 | v73.18,9.68 73.18,15.08
GND  (via drill 0.61)
  Top 0.254: IC3.7 96.68,7.46 96.68,20.48 IC4.7 97.63,21.59 96.68,22.54 96.68,40.32 96.76,40.4 | R31.2 76.36,22.7 76.36,28.1 76.44,28.18 | R30.2 76.44,28.18 | 76.44,35.8 76.36,35.72 76.36,28.26 76.44,28.18 | 76.44,35.8 R29.2 | R27.1 76.36,48.42 76.36,44.45 | 76.36,44.45 76.36,35.88 76.44,35.8 | 96.76,40.4 96.68,40.48 96.68,53.5 96.76,53.58 | 96.76,40.4 IC6.7 | IC7.7 96.76,53.58 | IC5.7 96.68,68.74 96.68,53.66 96.76,53.58 | R11.2 R10.2 R16.2 | R12.2 R13.2 | Q1.D 25.72,75.25 25.72,73.5 | 25.72,73.5 25.72,67.63 R25.1 | C20.1 C12.1 C13.1 43.18,73.5 | C14.1 43.18,73.5 | C15.1 C21.1 C22.1 C23.1 C16.1 C24.1 C25.1 C26.1 C17.1 C18.1 C19.1 C27.1 C1.1 C2.1 C3.1 | R24.1 R17.1 R18.1 R26.1 R19.1 69.85,69.37 68.74,70.48 68.74,75.09 | 68.74,75.09 R23.1 | C4.1 60.96,75.41 | 60.96,75.41 C9.1 C8.1 C7.1 C6.1 C5.1 60.33,56.52 60.33,53.98 R1.1 R2.1 R3.1 R4.1 R5.1 R6.1 R7.1 R8.1 R9.1 59.69,21.59 57.94,19.84 57.94,4.29 IC1.7 | 68.74,75.09 63.34,75.09 63.02,75.41 60.96,75.41 | IC2.7 40.16,4.29 40.16,5.87 IC2.5 | R22.1 69.37,25.88 69.37,28.26 68.74,28.89 68.74,29.53 69.85,30.64 R21.1 | R20.1 R28.1 | 43.18,73.5 25.72,73.5 | v75.88,44.45 76.36,44.45
  Bottom 0.254: IC3.13 86.84,15.72 88.42,15.72 IC3.11 90.17,14.13 97.63,21.59 IC4.7 | R29.2 95.25,36.83 IC6.7 | R14.2 29.37,29.05 21.43,29.05 R12.2 | R11.2 11.27,23.02 19.21,23.02 R13.2 | R16.2 13.18,65.25 23.34,65.25 R25.1 | C12.1 44.29,69.69 50.96,69.69 C22.1 | R32.2 76.36,71.28 62.07,71.28 C9.1 | IC1.7 58.74,3.49 50.64,3.49 50.48,3.65 43.02,3.65 IC2.7 | R28.1 69.69,40.8 60.8,40.8 60.72,40.88 | R4.1 60.72,40.88 | R22.1 69.69,25.24 62.55,25.24 61.12,26.67 R8.1 | C18.1 53.18,40.8 60.64,40.8 60.72,40.88 | R20.1 v75.88,44.45
N$1
  Top 0.254: C10.+ 7.06,71.68 | 7.06,71.68 X1.1 | IC9.1 7.14,71.91 7.14,71.75 7.06,71.68
N$2
  Top 0.254: R15.2 34.29,68.58 D2.C
  Bottom 0.254: Q1.G 26.04,78.11 29.69,78.11 31.75,76.04 R15.2
N$3
  Bottom 0.254: R10.1 6.51,31.91 6.51,34.29 LED1.K
N$4
  Top 0.254: D1.C D2.A
N$5  (via drill 0.61)
  Top 0.254: v14.13,29.84 14.13,34.13 LED2.K
  Bottom 0.254: R11.1 8.26,29.84 v14.13,29.84
N$6
  Bottom 0.254: R16.1 5.08,64.77 LED6.K
N$7  (via drill 0.61)
  Top 0.254: R12.1 13.18,28.42 v13.18,32.38
  Bottom 0.254: v13.18,32.38 13.97,33.18 20.48,33.18 LED3.K
N$9  (via drill 0.61)
  Top 0.254: v26.51,25.72 29.21,28.42 LED4.K
  Bottom 0.254: R13.1 14.29,25.72 v26.51,25.72
N$10  (via drill 0.61)
  Top 0.254: IC4.4 IC4.3 86.2,23.02 v86.2,40.96 | C12.2 46.83,67.15 46.83,59.85 D11.A | v83.82,42.55 83.66,42.7 83.66,57.31 v79.53,61.44 | v55.72,61.28 54.45,60.01 v54.45,57.63
  Bottom 0.254: v86.2,40.96 84.61,42.55 v83.82,42.55 | v79.53,61.44 79.38,61.59 78.26,61.59 77.79,62.07 56.52,62.07 v55.72,61.28 | v54.45,57.63 52.86,56.04 50.64,56.04 D11.A
N$11  (via drill 0.61)
  Top 0.254: R14.1 24.61,29.69 v24.61,32.38
  Bottom 0.254: v24.61,32.38 25.4,33.18 35.72,33.18 LED5.K
N$13  (via drill 0.61)
  Top 0.254: C14.2 44.29,72.23 44.29,63.18 | v44.29,58.74 44.29,63.18 | IC4.12 89.22,30.8 89.22,36.35 91.6,38.73 91.6,43.81 93.82,46.04 93.82,47.94 v91.12,50.64 | v88.11,50.64 86.2,52.55 v86.2,63.82 | 44.29,63.18 v41.27,63.18
  Bottom 0.254: IC4.12 89.38,30.96 96.04,30.96 IC4.8 | v44.29,58.74 43.97,58.42 38.58,58.42 37.15,56.99 12.86,56.99 D13.A | v88.11,50.64 v91.12,50.64 | v86.2,63.82 86.04,63.98 78.11,63.98 77.31,63.18 v41.27,63.18
N$14  (via drill 0.61)
  Top 0.254: IC2.4 44.45,12.7 v44.45,23.02 | v50.64,21.75 53.5,18.89 v53.5,17.78 | v87,16.67 89.06,14.61 89.06,7.46 IC3.4
  Bottom 0.254: v44.45,23.02 44.93,22.54 48.1,22.54 49.05,21.59 50.48,21.59 v50.64,21.75 | v53.5,17.78 54.61,16.67 v87,16.67
N$15  (via drill 0.61)
  Top 0.254: IC5.4 IC5.3 v84.61,66.83 | v44.45,56.67 41.12,53.34 v41.12,39.69 | v57.78,66.83 56.04,65.09 56.04,62.23 57.15,61.12 C16.2
  Bottom 0.254: C16.2 57.15,59.05 46.83,59.05 v44.45,56.67 | v41.12,39.69 40.8,39.37 D15.A | v57.78,66.83 v84.61,66.83
N$17  (via drill 0.61)
  Top 0.254: v53.98,42.07 53.5,42.55 v53.5,52.7 53.5,66.36 v53.98,66.83
  Bottom 0.254: IC5.12 88.9,76.2 89.38,76.2 89.85,75.72 94.46,75.72 | 94.46,75.72 96.04,75.72 IC5.8 | C18.2 56.99,42.07 v53.98,42.07 | v53.5,52.7 53.02,52.23 50.64,52.23 D17.A | 94.46,75.72 94.46,71.6 78.11,71.6 77.31,70.8 57.94,70.8 v53.98,66.83
N$19  (via drill 0.61)
  Top 0.254: C20.2 47.78,64.29 v47.78,61.59 | v21.43,59.69 21.91,59.21 21.91,45.4 D19.A | v87.63,44.93 IC6.3 | v55.72,60.01 v55.72,49.53
  Bottom 0.254: IC6.4 IC6.3 | 45.96,59.77 45.88,59.69 32.86,59.69 32.7,59.53 27.3,59.53 27.15,59.69 v21.43,59.69 | 45.96,59.77 v47.78,61.59 | v87.63,44.93 87.31,45.24 78.11,45.24 74.45,48.9 70.64,48.9 70.17,48.42 56.83,48.42 v55.72,49.53 | v55.72,60.01 55.4,59.69 46.04,59.69 45.96,59.77
N$20  (via drill 0.61)
  Top 0.254: v41.91,19.84 IC2.1 | v69.69,19.37 69.53,19.21 69.53,7.3 IC1.9
  Bottom 0.254: v41.91,19.84 42.39,19.37 v69.69,19.37
N$21  (via drill 0.61)
  Top 0.254: v62.39,13.81 61.91,13.34 61.91,7.3 IC1.6
  Bottom 0.254: IC2.2 42.07,15.08 47.62,15.08 48.9,13.81 v62.39,13.81
N$22  (via drill 0.61)
  Top 0.254: v53.5,6.51 IC2.8
  Bottom 0.254: v53.5,6.51 66.2,6.51 IC1.10
N$24  (via drill 0.61)
  Top 0.254: C22.2 53.18,72.55 53.18,76.52 52.39,77.31 39.37,77.31 39.37,76.99 36.67,74.3 27.78,74.3 27.78,77.47 27.15,78.11 25.24,78.11 25.24,68.58 22.86,66.2 22.86,52.07 D21.A | v82.71,49.05 81.44,50.32 81.44,56.52 81.92,56.99 81.92,57.78 v79.53,60.17 | v67.47,61.12 67.31,61.28 v67.31,67.79
  Bottom 0.254: IC6.8 96.04,48.74 89.38,48.74 IC6.12 87.63,47.15 85.72,49.05 v82.71,49.05 | v79.53,60.17 79.22,59.85 68.74,59.85 v67.47,61.12 | v67.31,67.79 66.99,67.47 60.17,67.47 59.05,68.58 C22.2
N$26  (via drill 0.61)
  Top 0.254: IC6.10 88.74,43.02 88.74,34.61 v87.15,33.02 | v31.75,50.01 32.38,49.37 32.38,40.16 38.1,34.45 38.1,31.75 D24.C
  Bottom 0.254: D24.C 40.64,31.75 59.85,31.75 60.33,31.27 62.39,31.27 64.29,29.37 69.69,29.37 R30.1 69.85,29.37 71.12,29.37 73.66,31.91 86.04,31.91 v87.15,33.02 | D21.C 15.24,52.07 27.46,52.07 28.26,51.28 30.48,51.28 v31.75,50.01
N$29  (via drill 0.61)
  Top 0.254: v84.93,35.72 85.09,35.88 IC6.2 | v19.05,41.59 22.54,38.1 v22.54,37.94 | v36.35,37.47 39.37,34.45 D23.C | v45.4,34.61 v45.4,41.27
  Bottom 0.254: R29.1 70.8,35.88 76.99,35.88 77.15,35.72 v84.93,35.72 | D19.C 15.56,41.59 v19.05,41.59 | v22.54,37.94 23.02,37.47 v36.35,37.47 | IC6.2 81.92,42.55 68.1,42.55 67.15,43.5 47.62,43.5 v45.4,41.27 | v45.4,34.61 45.09,34.29 D23.C
N$30  (via drill 0.61)
  Top 0.254: D6.A D5.A | D4.A D3.A 48.26,40.64 v48.26,33.34 47.78,32.86 47.78,6.83 IC2.9
  Bottom 0.254: IC2.9 50.48,4.13 58.58,4.13 58.74,3.97 80.17,3.97 IC3.1 | D5.A 11.43,35.4 11.11,35.4 10.32,34.61 10.32,31.43 38.58,31.43 40.48,33.34 v48.26,33.34
N$31  (via drill 0.61)
  Top 0.254: IC7.4 IC7.3 | v45.72,30.48 44.45,31.75 v44.45,55.4
  Bottom 0.254: 58.5,58.5 58.58,58.58 84.3,58.58 84.45,58.74 88.9,58.74 90.17,57.47 IC7.4 | 58.5,58.5 C24.2 | v45.72,30.48 D25.A | v44.45,55.4 47.62,58.58 58.42,58.58 58.5,58.5
N$32  (via drill 0.61)
  Top 0.254: D28.A 35.56,48.26 35.56,53.34 D29.A D30.A D9.A | D8.A D7.A | IC3.2 80.17,1.43 47.31,1.43 v47.31,46.99 47.31,47.31 D10.A
  Bottom 0.254: D9.A 35.56,63.5 25.4,63.5 D27.A 22.54,60.64 10.16,60.64 10.16,57.94 11.59,56.52 12.7,56.52 12.7,54.13 11.91,53.34 11.43,53.34 D8.A | v47.31,46.99 D28.A
N$34  (via drill 0.61)
  Top 0.254: 58.18,48.5 58.58,48.1 58.58,36.2 58.74,36.04 58.74,34.77 58.26,34.29 58.26,29.37 v55.72,26.83 | 58.18,48.5 C26.2 | v60.01,59.53 59.85,59.37 59.85,54.93 58.26,53.34 58.26,48.58 58.18,48.5
  Bottom 0.254: IC7.8 96.04,60.48 89.38,60.48 IC7.12 87.63,62.07 84.77,59.21 60.33,59.21 v60.01,59.53 | v55.72,26.83 52.86,23.97 50.64,23.97 D31.A
N$36  (via drill 0.61)
  Top 0.254: R32.1 71.6,70.64 v71.6,65.88 | v34.61,22.86 31.91,26.83 31.91,48.58 v30.48,50.01 30.64,50.01 30.64,58.74 v32.38,60.48 | v38.89,62.55 v42.23,65.88
  Bottom 0.254: IC7.10 89.06,65.88 v71.6,65.88 v42.23,65.88 | v34.61,22.86 D31.C | v30.48,50.01 29.69,50.8 D34.C | v38.89,62.55 36.83,60.48 v32.38,60.48
N$39  (via drill 0.61)
  Top 0.254: v83.5,30.96 83.98,31.43 83.98,41.43 86.2,43.66 86.2,51.75 85.09,52.86 IC7.2 | D33.C 15.72,56.67 15.72,30.96 v15.24,30.48 | v43.5,20.8 43.66,20.64 43.66,17.46 42.86,16.67 40.16,16.67 40.16,21.91 40.64,22.38 40.64,25.4 D25.C
  Bottom 0.254: v83.5,30.96 82.23,30.96 77.95,26.67 74.93,26.67 R31.1 69.53,21.27 56.83,21.27 55.88,20.32 43.97,20.32 v43.5,20.8 | v15.24,30.48 19.05,26.67 D25.C
NABTN1  (via drill 0.61)
  Top 0.254: D12.C 1.27,52.55 2.54,51.28 2.54,50.32 1.91,49.69 1.91,47.62 D7.C 1.43,46.99 2.7,45.72 2.7,29.21 3.97,27.94 v3.97,20.48 | R21.2 81.44,29.05 v81.44,26.51
  Bottom 0.254: IC4.5 90.96,23.34 84.61,23.34 v81.44,26.51 81.44,26.35 80.8,26.35 72.87,18.41 69.37,18.41 68.9,18.89 25.4,18.89 24.92,19.37 5.08,19.37 v3.97,20.48
NABTN2  (via drill 0.61)
  Top 0.254: D14.C 15.24,40.64 15.24,51.28 v14.13,52.39 | R22.2 77.31,25.56 v77.31,27.62 | v33.97,30.48 32.86,31.59 v32.86,38.42
  Bottom 0.254: R22.2 79.53,27.46 83.34,27.46 IC4.13 | v14.13,52.39 13.81,52.07 13.49,52.07 12.7,51.28 12.7,49.53 3.97,49.53 2.7,50.8 D8.C | v77.31,27.62 77.15,27.78 64.29,27.78 64.14,27.62 60.17,27.62 60.01,27.78 54.61,27.78 52.23,25.4 42.39,25.4 37.31,30.48 v33.97,30.48 | v32.86,38.42 32.54,38.1 23.65,38.1 22.38,39.37 D14.C
NABTN3  (via drill 0.61)
  Top 0.254: v92.55,74.3 92.55,70.01 IC5.5 | D16.C 38.1,39.37 38.1,40.16 33.34,44.93 v33.34,61.44 33.34,61.75 v36.51,64.93 | v58.58,72.39 v58.58,76.52
  Bottom 0.254: v92.55,74.3 90.49,74.3 89.06,75.72 77.95,75.72 R23.2 76.83,76.83 70.64,76.83 69.69,77.79 59.85,77.79 v58.58,76.52 | v33.34,61.44 32.54,62.23 D9.C | v58.58,72.39 53.98,67.79 52.7,67.79 51.75,66.83 39.37,66.83 37.47,64.93 v36.51,64.93
NABTN4  (via drill 0.61)
  Top 0.254: R24.2 78.58,54.45 v78.58,62.55 78.58,72.71 v80.17,74.3 | IC5.13 82.07,74.45 v82.07,74.3 | D10.C 40.64,50.8 40.64,59.69 D18.C
  Bottom 0.254: v78.58,62.55 41.91,62.55 40.32,60.96 D18.C | v80.17,74.3 v82.07,74.3
NABTN5  (via drill 0.61)
  Top 0.254: IC6.5 92.08,38.73 92.08,30.64 91.28,29.84 v91.28,4.76 | v17.78,4.45 13.97,8.26 13.97,25.24 11.59,27.62 11.59,33.02 12.7,34.13 12.7,45.72 12.78,45.8 | D20.C 12.78,45.8 | D27.C 12.7,60.96 12.7,45.88 12.78,45.8
  Bottom 0.254: R25.2 30.32,64.61 16.35,64.61 D27.C | v91.28,4.76 87.95,1.43 31.11,1.43 28.1,4.45 v17.78,4.45
NABTN6  (via drill 0.61)
  Top 0.254: D22.C D28.C 25.4,48.26 25.4,58.9 31.43,64.93 35.56,64.93 35.56,68.9 39.05,72.39 40.64,72.39 v40.64,65.88 | IC6.13 84.61,47.47 v84.61,50.96 | v78.26,51.12 76.36,53.02 76.36,63.66 R26.2
  Bottom 0.254: v84.61,50.96 84.45,51.12 v78.26,51.12 | v40.64,65.88 42.86,63.66 76.36,63.66 R26.2
NABTN7  (via drill 0.61)
  Top 0.254: R27.2 71.6,51.28 v71.6,53.02
  Bottom 0.254: D26.C 15.24,55.88 25.4,55.88 D29.C 26.67,54.77 27.78,55.88 42.7,55.88 44.13,54.45 48.9,54.45 49.05,54.61 70.17,54.61 71.6,53.18 v71.6,53.02 73.03,54.45 78.42,54.45 80.01,52.86 90.96,52.86 IC7.5
NABTN8  (via drill 0.61)
  Top 0.254: R28.2 80.96,40.64 v80.96,57.31 | v84.61,57.78 85.09,58.26 IC7.13 | D32.C 25.56,25.24 25.56,36.51 29.53,40.48 v29.53,41.91 29.53,55.56 D30.C | v43.5,40.32 43.02,40.8 v43.02,42.86
  Bottom 0.254: v80.96,57.31 81.44,57.78 v84.61,57.78 | R28.2 76.36,39.53 68.1,39.53 67.31,40.32 v43.5,40.32 | v43.02,42.86 42.7,43.18 38.58,43.18 37.31,41.91 v29.53,41.91
OK1  (via drill 0.61)
  Top 0.254: IC6.6 IC6.9 94.3,47.94 94.3,53.5 93.82,53.98 v93.82,63.82 | v22.54,67.15 22.38,66.99 22.38,48.74 D20.A | C21.2 v59.69,69.85
  Bottom 0.254: C21.2 54.93,70.17 33.02,70.17 30,67.15 v22.54,67.15 | v93.82,63.82 89.85,67.79 83.82,67.79 83.5,67.47 68.9,67.47 66.52,69.85 v59.69,69.85
OK2  (via drill 0.61)
  Top 0.254: C23.2 58.9,63.02 v58.9,57.63 | v79.53,56.04 80.01,55.56 v80.01,54.13 v80.01,43.5 | v45.4,46.04 45.88,46.51 v45.88,55.4
  Bottom 0.254: 60.88,55.64 60.96,55.56 79.06,55.56 v79.53,56.04 | 60.88,55.64 v58.9,57.63 | v80.01,54.13 80.49,54.61 IC7.1 | IC6.11 90.17,43.5 v80.01,43.5 | D22.A 38.1,44.45 43.81,44.45 v45.4,46.04 | v45.88,55.4 46.83,56.36 48.58,56.36 49.37,55.56 60.8,55.56 60.88,55.64
OK3
  Top 0.254: IC7.6 IC7.9
  Bottom 0.254: IC7.6 92.71,52.07 58.42,52.07 C25.2 57.15,53.18 55.24,53.18 53.82,51.75 41.75,51.75 41.43,52.07 28.26,52.07 27.78,52.55 26.19,52.55 D26.A
PWRON  (via drill 0.61)
  Top 0.254: IC2.6 43.66,3.33 43.66,2.22 42.86,1.43 30.64,1.43 30.64,17.14 27.62,20.16 26.99,20.16 26.99,20.64 21.43,26.19 21.43,30.48 17.94,33.97 v17.94,61.59
  Bottom 0.254: v17.94,61.59 20.48,64.14 34.45,64.14 37.62,67.31 D1.A
REAL_GND
  Top 0.254: C10.- 13.97,69.85 IC9.2
  Bottom 0.254: X1.2 6.99,74.3 12.06,74.3 IC9.2 | Q1.S R15.1 21.59,68.58 C11.- 19.05,67.31 13.97,67.31 C10.-
RLED1  (via drill 0.61)
  Top 0.254: IC4.6 IC4.9 93.82,30.64 v93.82,37.78 | LED1.A 3.97,34.45 v3.97,50.8 | v41.12,38.42 38.1,41.43 38.1,43.97 35.08,46.99 35.08,62.23 39.37,66.52 v39.37,71.12
  Bottom 0.254: v3.97,50.8 7.78,54.61 9.05,54.61 | D12.A 9.05,54.61 | C13.2 46.51,70.64 39.37,70.64 | 39.37,70.64 32.7,70.64 30.16,68.1 21.59,68.1 19.21,65.72 12.22,65.72 9.05,62.55 9.05,54.61 | v93.82,37.78 93.66,37.62 78.11,37.62 77.79,37.94 68.58,37.94 67.63,36.99 54.61,36.99 52.23,39.37 49.05,39.37 48.1,38.42 v41.12,38.42 | 39.37,70.64 v39.37,71.12
RLED2  (via drill 0.61)
  Top 0.254: LED3.A 21.75,36.99 24.13,36.99 D14.A 20.48,43.02 20.48,66.99 22.54,69.06 v22.54,76.99 | v90.17,32.7 IC4.11 | v75.25,34.92 74.93,35.24 74.93,56.36 75.88,57.31 v75.88,68.42 74.93,69.37 74.93,76.2 v73.34,77.79
  Bottom 0.254: v90.17,32.7 88.11,34.77 75.41,34.77 v75.25,34.92 | v75.88,68.42 77.31,69.85 IC5.1 | 57.15,78.26 C15.2 | 57.15,78.26 72.87,78.26 v73.34,77.79 | v22.54,76.99 24.29,78.74 56.67,78.74 57.15,78.26
RLED3  (via drill 0.61)
  Top 0.254: IC5.9 95.25,73.34 | 95.25,73.34 IC5.6 | D16.A 50.8,39.37 50.8,44.13 v51.12,44.45 50.96,44.45 50.96,73.34 v51.12,73.5 | v93.5,73.34 95.25,73.34
  Bottom 0.254: LED2.A 13.65,36.51 47.94,36.51 D16.A | C17.2 55.88,44.45 v51.12,44.45 | v93.5,73.34 77.95,73.34 77.79,73.5 v51.12,73.5
RLED4  (via drill 0.61)
  Top 0.254: v87.47,74.77 IC5.11 | v51.12,74.77 49.53,73.18 D18.A | LED4.A 30.96,38.58 v30.96,39.05 | IC3.3 72.87,21.11 v72.87,32.38 | v57.63,36.04 57.15,36.51 C19.2 | v62.71,74.45 62.71,61.44 63.66,60.48 v63.66,35.56
  Bottom 0.254: v87.47,74.77 87,75.25 77.95,75.25 77.47,74.77 62.71,74.77 | v51.12,74.77 62.71,74.77 | v30.96,39.05 32.54,40.64 41.91,40.64 43.18,39.37 48.26,39.37 48.74,39.85 55.4,39.85 C19.2 | v72.87,32.38 69.22,36.04 63.66,36.04 | v57.63,36.04 63.66,36.04 | v62.71,74.45 62.71,74.77 | 63.66,36.04 v63.66,35.56
VCC  (via drill 0.61)
  Top 0.254: IC7.14 81.12,63.66 81.12,65.41 | 81.12,65.41 81.12,76.04 IC5.14 | IC6.14 IC6.1 IC4.14 IC4.1 IC3.14 | 81.12,65.41 88.74,65.41 v88.74,59.85 | IC2.14 48.26,19.05 48.26,23.81 48.34,23.89 | v48.74,24.29 48.34,23.89 | v35.88,20.8 32.86,17.78 v32.86,17.46 | SW6.3 22.23,9.21 24.13,11.11 24.13,14.76 22.23,16.67 SW3.3 | 3.73,3.41 3.81,3.49 3.81,7.14 3.73,7.22 | 3.73,3.41 1.91,1.59 SW7.3 | 3.73,7.22 1.91,9.05 SW4.3 | 3.73,14.84 3.81,14.76 3.81,7.3 3.73,7.22 | 3.73,14.84 1.91,16.67 SW1.3 | 10.87,2.62 10.16,3.33 3.81,3.33 3.73,3.41 | 10.87,2.62 11.91,1.59 SW8.3 | 10.87,2.62 13.97,5.71 13.97,7.14 12.06,9.05 SW5.3 | 4.92,14.92 3.81,14.92 3.73,14.84 | 4.92,14.92 10.16,14.92 11.91,16.67 SW2.3 | LED6.A 4.92,66.2 4.92,14.92 | v61.75,32.23 v61.75,39.21 | v49.85,32.7 48.26,31.11 48.26,23.97 48.34,23.89
  Bottom 0.254: IC1.14 67.47,17.94 75.25,17.94 78.9,21.59 IC4.1 | v88.74,59.85 92.23,56.36 95.57,56.36 96.36,55.56 96.36,51.59 86.52,51.59 84.93,50.01 82.39,50.01 81.76,49.37 81.76,46.99 IC6.14 | v48.74,24.29 48.42,23.97 42.23,23.97 39.05,20.8 v35.88,20.8 | v32.86,17.46 32.38,17.94 23.34,17.94 22.23,16.83 SW3.3 | LED6.A 3.81,69.85 16.51,69.85 | C11.+ 16.51,69.85 | 16.51,69.85 IC9.3 | SW9.3 22.07,1.59 20.95,2.7 13.18,2.7 12.06,1.59 SW8.3 | SW6.3 22.07,9.21 20.95,10.32 13.18,10.32 12.06,9.21 SW5.3 | IC6.1 82.23,39.05 67.79,39.05 67.63,39.21 v61.75,39.21 | v61.75,32.23 61.28,32.7 v49.85,32.7